# Altium schematic sheet ADS1115.SchDoc
size A4
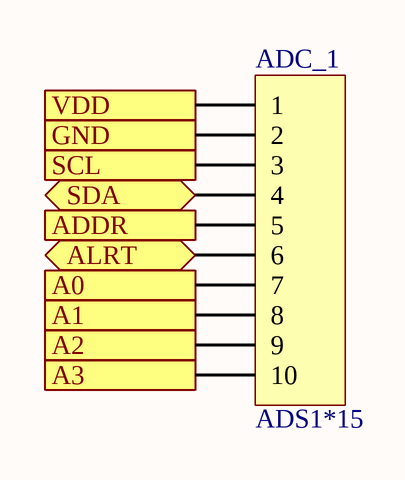
[diagram p0: ADS1115.SchDoc]

## Parts
ADC_1  ADS1*15  [HDR1X10]

## Ports
A0 (in), A1 (in), A2 (in), A3 (in), ADDR (in), ALRT (bidir), GND (out), SCL (in), SDA (bidir), VDD (in)

## Nets
A0: ADC_1.7 ; port A0
A1: ADC_1.8 ; port A1
A2: ADC_1.9 ; port A2
A3: ADC_1.10 ; port A3
ADDR: ADC_1.5 ; port ADDR
ALRT: ADC_1.6 ; port ALRT
GND: ADC_1.2 ; port GND
SCL: ADC_1.3 ; port SCL
SDA: ADC_1.4 ; port SDA
VDD: ADC_1.1 ; port VDD

## Library data of the parts
ADC_1 = Header 10: Header, 10-Pin; LatestRevisionDate: 17-Jul-2002; LatestRevisionNote: Re-released for DXP Platform.; Publisher: Altium Limited